# Altium project DSpico.PrjPcb
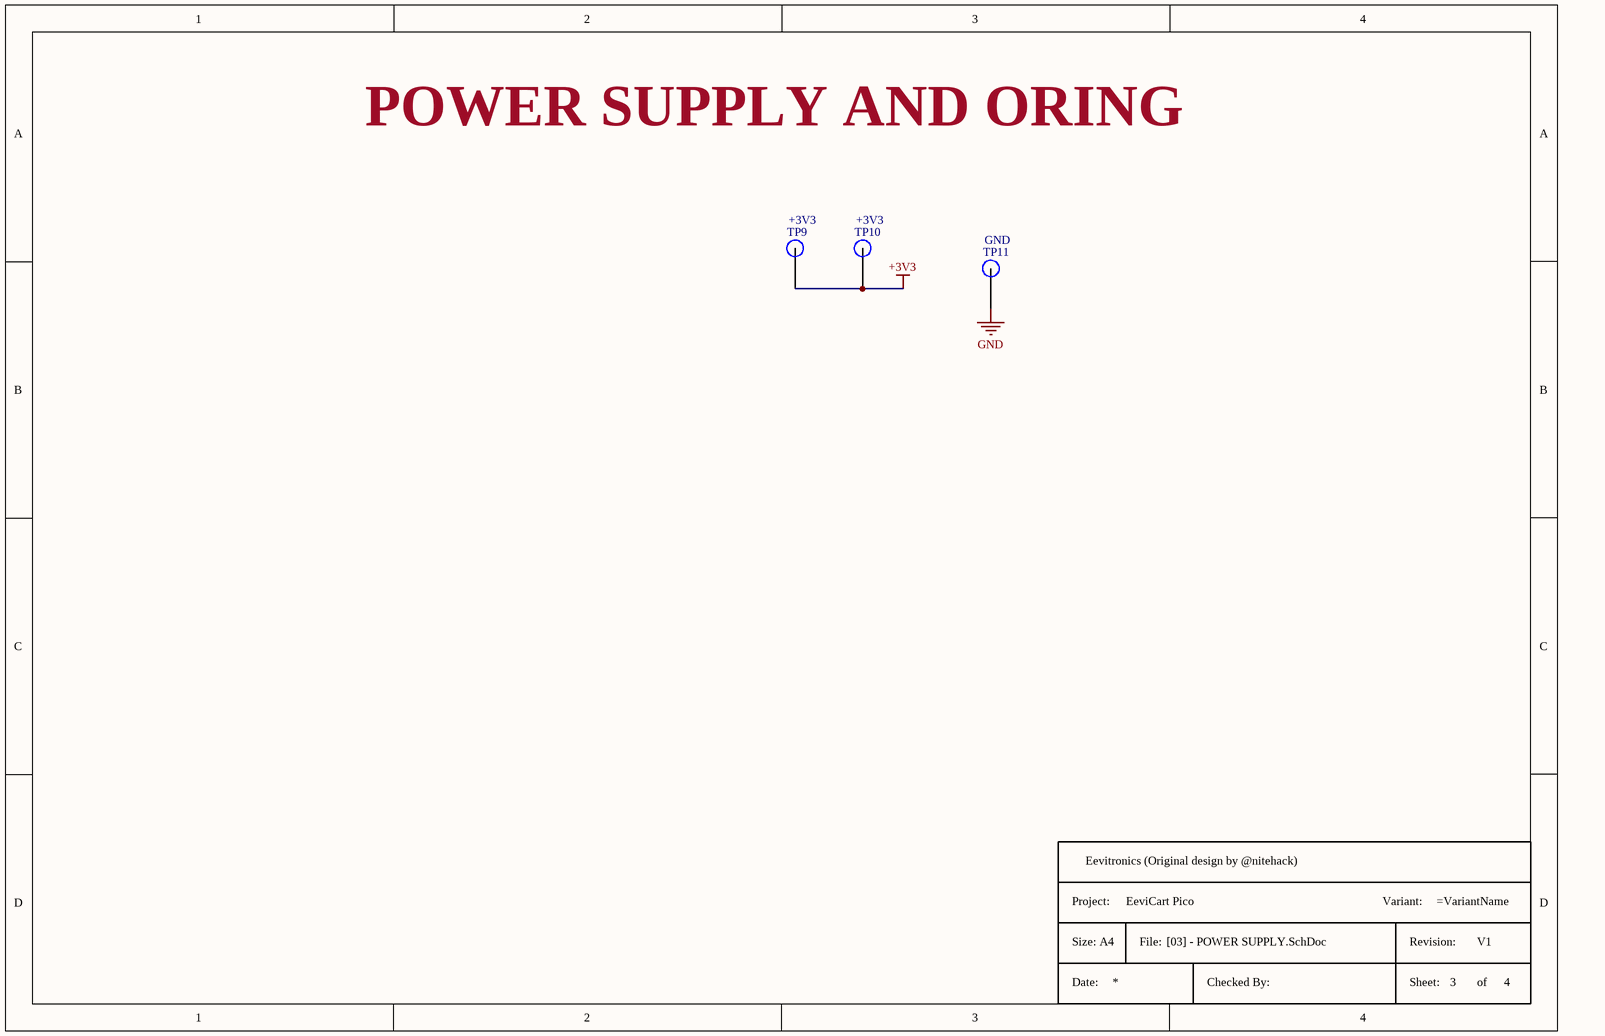
[diagram p0: [03] - POWER SUPPLY.SchDoc]
Year: 2026; VersionRevision: V1; Project: EeviCart Pico; Company: Eevitronics (Original design by @nitehack)
2 sheets, 54 parts. Net scope: global (net labels, ports and power ports of the same name join across sheets).
Board file: DSpico_PCB.PcbDoc
Sheets:
  [03] - POWER SUPPLY.SchDoc
  [04] - RP2040.SchDoc

## Sheet [03] - POWER SUPPLY.SchDoc
size A4; DocumentNumber: 3; SheetNumber: 3; SheetTotal: 4

### Parts
*?  Title Block A4  (value not drawn)  (graphical)
TP9  +3V3  [Test Point]
TP10  +3V3  [Test Point]
TP11  GND  [Test Point]

### Nets
+3V3: TP9.1 TP10.1
GND: TP11.1

### Notes on the sheet
- POWER SUPPLY AND ORING
- (in symbol Title Block A4) Project:; Variant:; Size: A4; File:; Revision:; Date:; Checked By:; Sheet:; of

### Library data of the parts
TP9-TP11 = Test Point

## Sheet [04] - RP2040.SchDoc
size A3; DocumentNumber: 4; SheetNumber: 4; SheetTotal: 4
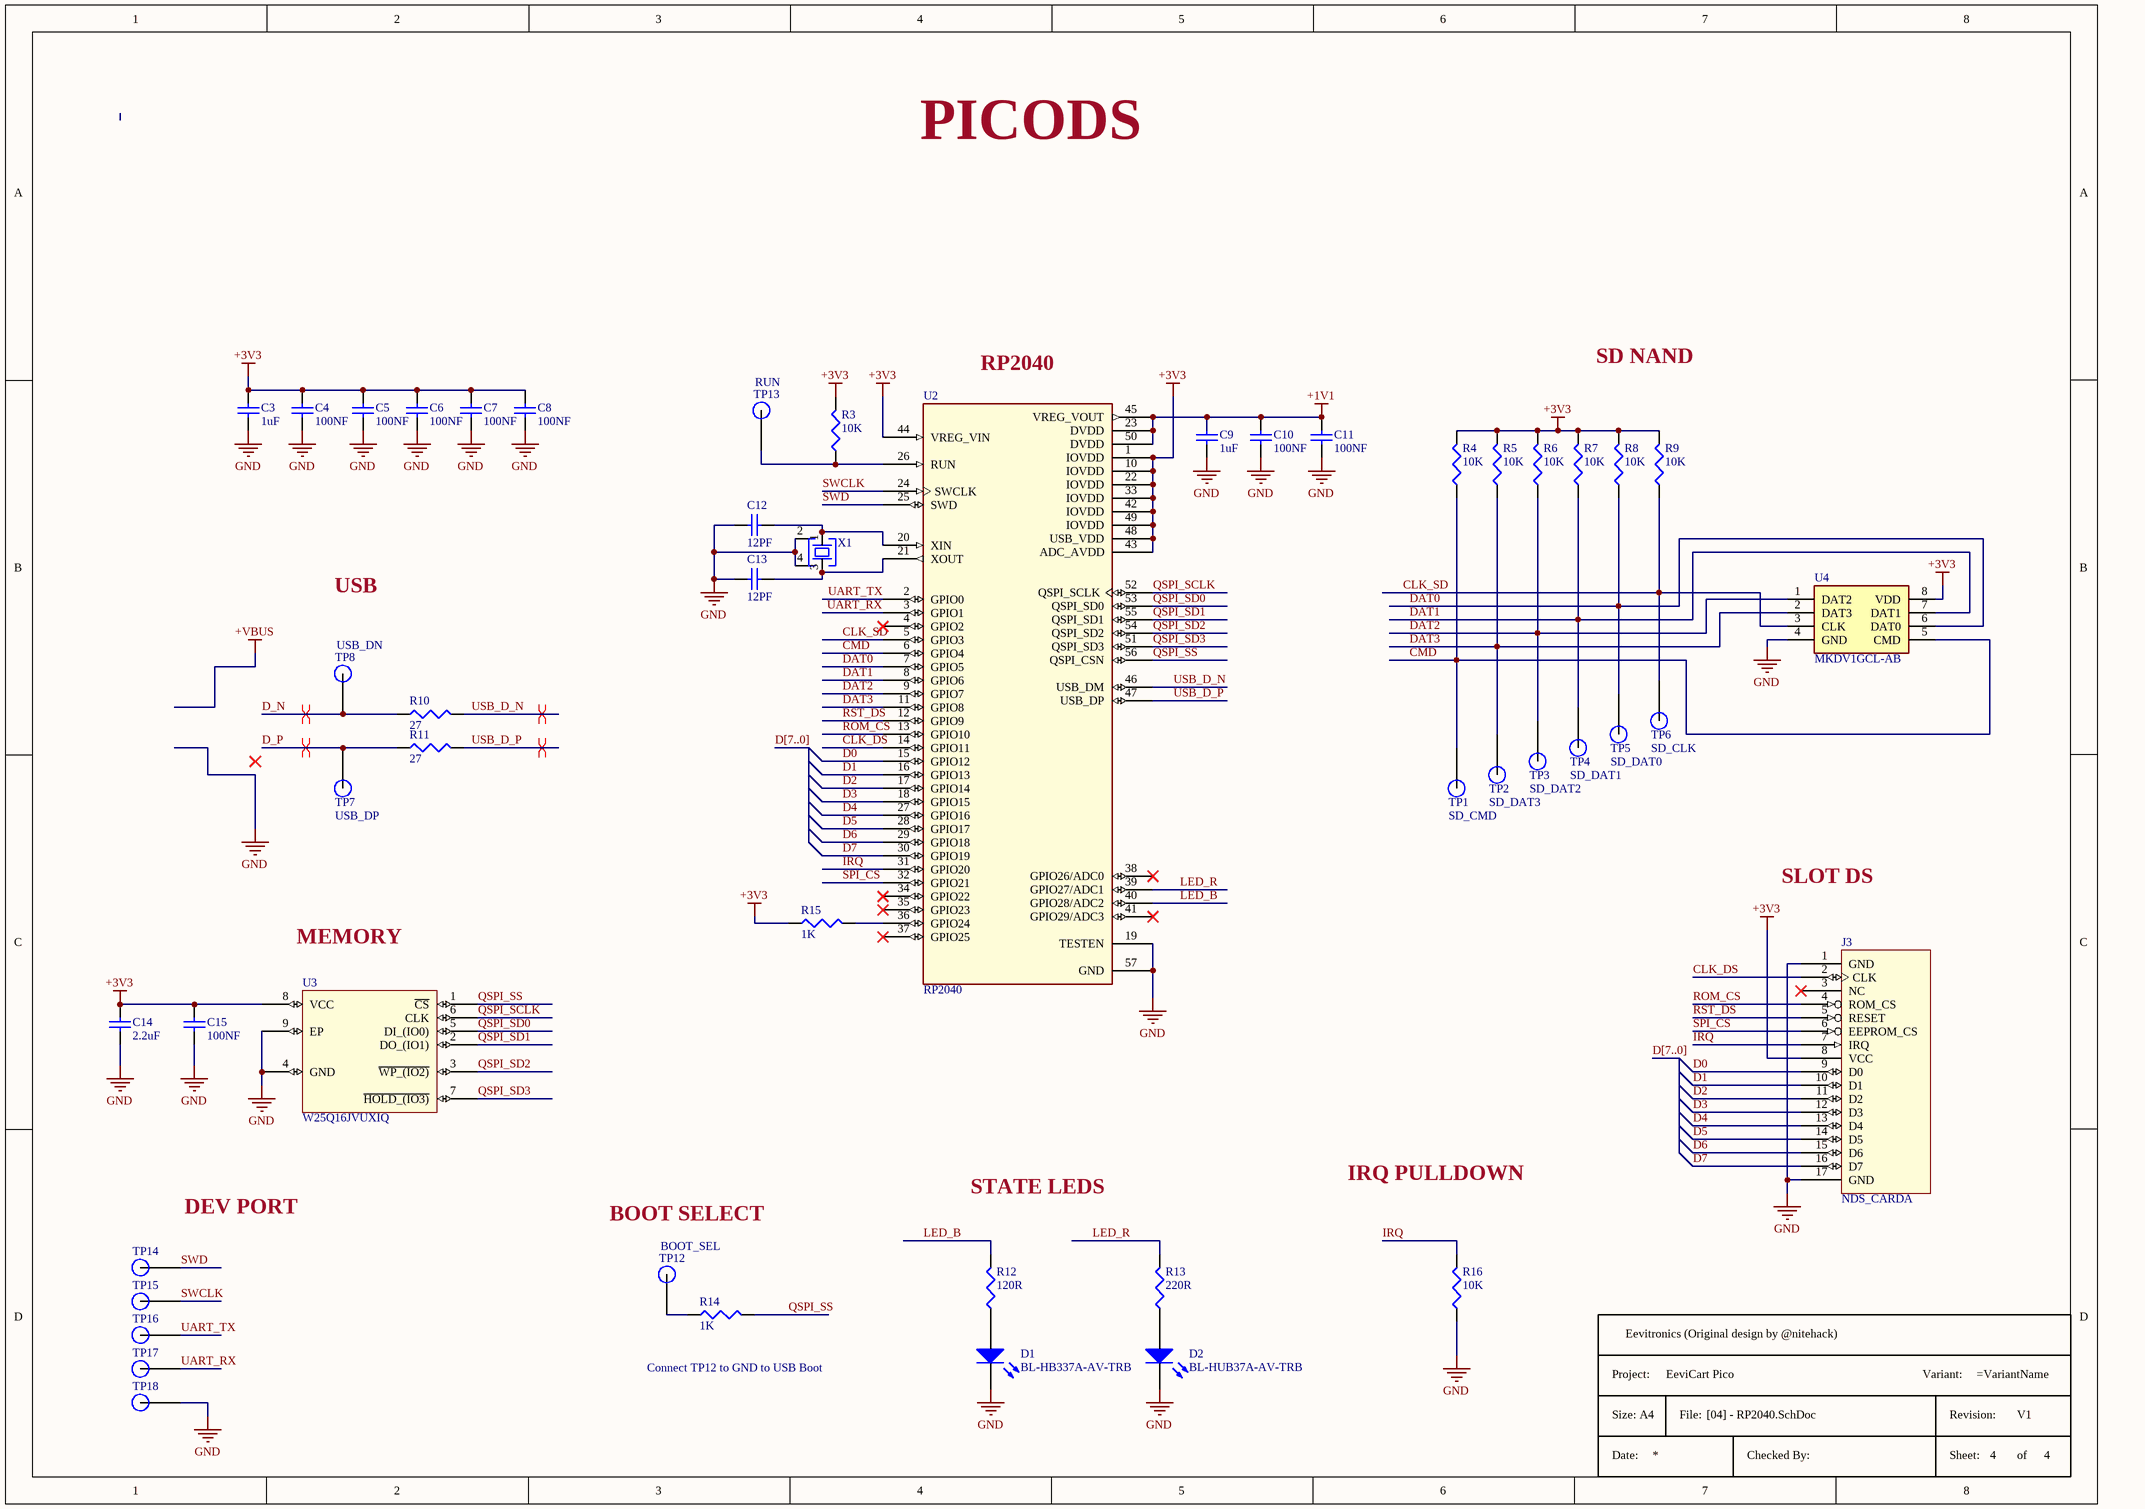
[diagram p1: [04] - RP2040.SchDoc]

### Parts
*  Title Block A4  (value not drawn)  (graphical)
C3  1uF  [C0402]
C4  100NF  [C0402]
C5  100NF  [C0402]
C6  100NF  [C0402]
C7  100NF  [C0402]
C8  100NF  [C0402]
C9  1uF  [C0402]
C10  100NF  [C0402]
C11  100NF  [C0402]
C12  12PF  [C0402]
C13  12PF  [C0402]
C14  2.2uF  [C0402]
C15  100NF  [C0402]
D1  BL-HB337A-AV-TRB  [LED0402-RD]
D2  BL-HUB37A-AV-TRB  [LED0402-RD]
J3  NDS_CARDA  [NDS_CARD]  (no BOM)
R3  10K  [R0402]
R4  10K  [R0402]
R5  10K  [R0402]
R6  10K  [R0402]
R7  10K  [R0402]
R8  10K  [R0402]
R9  10K  [R0402]
R10  value 27  [R0402]  (hidden comment: RC0402FR-0727RL)
R11  value 27  [R0402]  (hidden comment: RC0402FR-0727RL)
R12  120R  [R0402]
R13  220R  [R0402]
R14  1K  [R0402]
R15  1K  [R0402]
R16  10K  [R0402]
TP1  SD_CMD  [Test Point]
TP2  SD_DAT3  [Test Point]
TP3  SD_DAT2  [Test Point]
TP4  SD_DAT1  [Test Point]
TP5  SD_DAT0  [Test Point]
TP6  SD_CLK  [Test Point]
TP7  USB_DP  [Test Point]
TP8  USB_DN  [Test Point]
TP12  BOOT_SEL  [Test Point]
TP13  RUN  [Test Point]
TP14  (no value)  [Test Point]
TP15  (no value)  [Test Point]
TP16  (no value)  [Test Point]
TP17  (no value)  [Test Point]
TP18  (no value)  [Test Point]
U2  RP2040  [QFN40P700X700X90-57N]
U3  W25Q16JVUXIQ  [SON50P300X200X60-9N]
U4  MKDV1GCL-AB  [SON127P800X600X80-8N]
X1  XYDBPCNANF-12MHZ  [OSC-SMD_4P-L2.5-W2.0-BL]  (value not drawn)

### Nets
+1V1: C9.2 C10.2 C11.2 U2.23(DVDD) U2.45(VREG_VOUT) U2.50(DVDD)
+3V3: C3.2 C4.2 C5.2 C6.2 C7.2 C8.2 C14.2 C15.2 J3.8(VCC) R3.2 R4.2 R5.2 R6.2 R7.2 R8.2 R9.2 R15.1 U2.1(IOVDD) U2.10(IOVDD) U2.22(IOVDD) U2.33(IOVDD) U2.42(IOVDD) U2.43(ADC_AVDD) U2.44(VREG_VIN) U2.48(USB_VDD) U2.49(IOVDD) U3.8(VCC) U4.8(VDD)
GND: C3.1 C4.1 C5.1 C6.1 C7.1 C8.1 C9.1 C10.1 C11.1 C12.1 C13.1 C14.1 C15.1 D1.1 D2.1 J3.1(GND) J3.17(GND) R16.1 TP18.1 U2.19(TESTEN) U2.57(GND) U3.4(GND) U3.9(EP) U4.4(GND) X1.2 X1.4
CLK_DS: J3.2(CLK) U2.14(GPIO11)
CLK_SD: R9.1 TP6.1 U2.5(GPIO3) U4.3(CLK)
CMD: R4.1 TP1.1 U2.6(GPIO4) U4.5(CMD)
D0: J3.9(D0) U2.15(GPIO12)
D1: J3.10(D1) U2.16(GPIO13)
D2: J3.11(D2) U2.17(GPIO14)
D3: J3.12(D3) U2.18(GPIO15)
D4: J3.13(D4) U2.27(GPIO16)
D5: J3.14(D5) U2.28(GPIO17)
D6: J3.15(D6) U2.29(GPIO18)
D7: J3.16(D7) U2.30(GPIO19)
D_N: R10.1 TP8.1
D_P: R11.1 TP7.1
DAT0: R8.1 TP5.1 U2.7(GPIO5) U4.6(DAT0)
DAT1: R7.1 TP4.1 U2.8(GPIO6) U4.7(DAT1)
DAT2: R6.1 TP3.1 U2.9(GPIO7) U4.1(DAT2)
DAT3: R5.1 TP2.1 U2.11(GPIO8) U4.2(DAT3)
IRQ: J3.7(IRQ) R16.2 U2.31(GPIO20)
LED_B: R12.2 U2.40(GPIO28/ADC2)
LED_R: R13.2 U2.39(GPIO27/ADC1)
QSPI_SCLK: U2.52(QSPI_SCLK) U3.6(CLK)
QSPI_SD0: U2.53(QSPI_SD0) U3.5(DI_(IO0))
QSPI_SD1: U2.55(QSPI_SD1) U3.2(DO_(IO1))
QSPI_SD2: U2.54(QSPI_SD2) U3.3(~{WP_(IO2)})
QSPI_SD3: U2.51(QSPI_SD3) U3.7(~{HOLD_(IO3)})
QSPI_SS: R14.2 U2.56(QSPI_CSN) U3.1(~{CS})
ROM_CS: J3.4(ROM_CS) U2.13(GPIO10)
RST_DS: J3.5(RESET) U2.12(GPIO9)
SPI_CS: J3.6(EEPROM_CS) U2.32(GPIO21)
SWCLK: TP15.1 U2.24(SWCLK)
SWD: TP14.1 U2.25(SWD)
UART_RX: TP17.1 U2.3(GPIO1)
UART_TX: TP16.1 U2.2(GPIO0)
USB_D_N: R10.2 U2.46(USB_DM)
USB_D_P: R11.2 U2.47(USB_DP)
NetC12_2: C12.2 U2.20(XIN) X1.1
NetC13_2: C13.2 U2.21(XOUT) X1.3
NetD1_2: D1.2 R12.1
NetD2_2: D2.2 R13.1
NetR3_1: R3.1 TP13.1 U2.26(RUN)
NetR14_1: R14.1 TP12.1
NetR15_2: R15.2 U2.36(GPIO24)

Not connected (* = marked no-connect by the designer): J3 3(NC)*; U2 4(GPIO2)* 34(GPIO22)* 35(GPIO23)* 37(GPIO25)* 38(GPIO26/ADC0)* 41(GPIO29/ADC3)*

### Buses and harness runs
bus D[7..0]

### Layout directives
differential pair: D_N, D_P, USB_D_N, USB_D_P

### Notes on the sheet
- PICODS
- (near U2) RP2040
- SD NAND
- USB
- SLOT DS
- MEMORY
- IRQ PULLDOWN
- DEV PORT
- (near TP12) BOOT SELECT
- STATE LEDS
- (near R14) Connect TP12 to GND to USB Boot
- (in symbol Title Block A4) Project:; Variant:; Size: A4; File:; Revision:; Date:; Checked By:; Sheet:; of

### Library data of the parts
C3 C9 = C1005X5R1E105K050BC: TDK - C1005X5R1E105K050BC - COND, CERÁ MULT, X5R, 1UF, 25V, 0402; Dielectric Material: Ceramic; Tolerance: 10%; Supplier 1: Farnell; Supplier Part Number 1: 2346884; RoHS: YES; Stock: 131328; Pricing: 10=0,0948, 100=0,0638, 500=0,0468, 2500=0,0336, 5000=0,028, 10000=0,021, 50000=0,0175, 100000=0,0153 (EUR); ComponentLink1URL: http://www.farnell.com/datasheets/1796654.pdf; ComponentLink1Description: http://www.farnell.com/datasheets/1796654.pdf; .PCBCheck: *; .SCHCheck: *; Supplier 2: RSComponents; Supplier 3: Mouser; Supplier 4: Digi-Key; Supplier Part Number 2: 1110310; Supplier Part Number 3: 810-C1005X5R1E105K; Supplier Part Number 4: 445-9066-1-ND; Storage Location: C1-F2; Manufacturer: TDK; Manufacturer Part Number: C1005X5R1E105K050BC; Mount: Surface Mount; Case/Package: 0402; Weight: 2.3E-05oz; Case Code (Metric): 1005; Case Code (Imperial): 0402; Min Operating Temperature: -55°C; Max Operating Temperature: 85°C; Packaging: Tape and Reel; Capacitance: 1uF; Voltage Rating: 25V; Termination: SMD/SMT; Package Quantity: 1; Voltage Rating (DC): 25V; Dielectric: X5R; Composition: Ceramic; Length: 1mm; Height: 0.5mm; Width: 0.02inch; Thickness: 0.022inch; Depth: 0.5mm; Radiation Hardening: No; REACH SVHC: No SVHC; Lead Free: Lead Free
C4-C8 C10 C11 C15 = GRM155R71C104KA88D: 0402 0.1 uF 16V ±10 % Tolerance X7R SMT Multilayer Ceramic Capacitor; Manufacturer: Murata; Tolerance: 10%; Insulation Resistance: 10GR; Supplier 1: Digi-Key; Manufacturer Part Number: GRM155R71C104KA88D; RoHS: Yes; Category: Ceramic Capacitors; Stock 1: 30795639; Pricing 1: 1=0,10000, 10=0,02200, 50=0,01180, 100=0,00960, 500=0,00688, 1000=0,00541, 2500=0,00492, 5000=0,00452 (USD); Mount: Surface Mount; Case/Package: 0402; Number of Pins: 2; Case Code (Metric): 1005; Case Code (Imperial): 0402; Material: Ceramic; Dielectric Material: Ceramic; Min Operating Temperature: -55°C; Max Operating Temperature: 125°C; Capacitance: 100nF; Dielectric: X7R; Voltage Rating: 16V; Packaging: Tape and Reel; Voltage Rating (DC): 16V; Package Quantity: 1; Termination: SMD/SMT; Voltage: 16V; Length: 1mm; Width: 0.5mm; Height: 0.5mm; Thickness: 0.022inch; Depth: 0.5mm; Radiation Hardening: No; REACH SVHC: No SVHC; Lead Free: Lead Free; RoHS Compliant: Yes; ComponentLink1URL: https://datasheet.ciiva.com/129/grm155r71c104ka88-01-129739.pdf?src-supplier=Digi-Key; ComponentLink1Description: https://datasheet.ciiva.com/129/grm155r71c104ka88-01-129739.pdf?src-supplier=Digi-Key; ComponentLink2URL: https://datasheet.ciiva.com/129/grm155r71c104ka88-01-129740.pdf?src-supplier=Digi-Key; ComponentLink2Description: https://datasheet.ciiva.com/129/grm155r71c104ka88-01-129740.pdf?src-supplier=Digi-Key; ComponentLink3URL: https://datasheet.ciiva.com/18102/getdatasheetpartid-85307-18102905.pdf?src-supplier=Verical; ComponentLink3Description: https://datasheet.ciiva.com/18102/getdatasheetpartid-85307-18102905.pdf?src-supplier=Verical; ComponentLink4URL: https://datasheet.ciiva.com/29199/454098-da-01-en-vs-kondensator-0402-29199799.pdf?src-supplier=Conrad; ComponentLink4Description: https://datasheet.ciiva.com/29199/454098-da-01-en-vs-kondensator-0402-29199799.pdf?src-supplier=Conrad; ComponentLink5URL: https://datasheet.ciiva.com/7937/4360-7937615.pdf?src-supplier=Element14; ComponentLink5Description: https://datasheet.ciiva.com/7937/4360-7937615.pdf?src-supplier=Element14; ComponentLink6URL: https://datasheet.ciiva.com/14116/grmseries-highdielectrictype-eng-14116878.pdf?src-supplier=Distrelec; ComponentLink6Description: https://datasheet.ciiva.com/14116/grmseries-highdielectrictype-eng-14116878.pdf?src-supplier=Distrelec; ComponentLink7URL: https://datasheet.ciiva.com/14103/grmseries-highdielectrictype-eng-14103750.pdf?src-supplier=Distrelec; ComponentLink7Description: https://datasheet.ciiva.com/14103/grmseries-highdielectrictype-eng-14103750.pdf?src-supplier=Distrelec; ComponentLink8URL: https://datasheet.ciiva.com/28534/4360-28534127.pdf?src-supplier=Element14; ComponentLink8Description: https://datasheet.ciiva.com/28534/4360-28534127.pdf?src-supplier=Element14; ComponentLink9URL: https://datasheet.ciiva.com/28534/4360-28534133.pdf?src-supplier=Element14; ComponentLink9Description: https://datasheet.ciiva.com/28534/4360-28534133.pdf?src-supplier=Element14; ComponentLink10URL: https://datasheet.ciiva.com/16199/product-16199000.pdf?src-supplier=Future+Electronics; ComponentLink10Description: https://datasheet.ciiva.com/16199/product-16199000.pdf?src-supplier=Future+Electronics; Supplier Part Number 1: 490-3261-1-ND
C12 C13 = 04025A120JAT2A: CAP CER 12PF 50V C0G/NP0 0402; Manufacturer: Kyocera AVX; Tolerance: 5%; Dielectric: C0G; Temperature Coefficient: 30ppm/°C; Insulation Resistance: 100GR; Supplier 1: Newark; Manufacturer Part Number: 04025A120JAT2A; RoHS: Yes; Category: Ceramic Capacitors; Mount: Surface Mount,PCB; Case/Package: 0402; Number of Pins: 2; Case Code (Metric): 1005; Case Code (Imperial): 0402; Min Operating Temperature: -55°C; Max Operating Temperature: 125°C; Packaging: Tape and Reel; Capacitance: 12pF; Voltage Rating: 50V; Voltage Rating (DC): 50V; Package Quantity: 1; Series: -; Termination: SMD/SMT; Construction: Flat; Voltage: 50V; Length: 1mm; Width: 0.02inch; Height: 0.5mm; Depth: 0.5mm; Thickness: 0.022inch; Radiation Hardening: No; Lead Free: Lead Free; RoHS Compliant: Yes; Reach SVHC Compliant: Yes; Supplier Part Number 1: 96M1132
C14 = C1005X5R1A225K050BC: TDK - C1005X5R1A225K050BC - COND, CERÁ MULT, X5R, 2.2UF, 10V, 0402; .PCBCheck: VMM; Supplier 1: Farnell; Manufacturer: TDK; Manufacturer Part Number: C1005X5R1A225K050BC; RoHS: YES; Stock 1: 13179; Pricing 1: 5=0.142, 300=0.0926, 1000=0.0836, 2500=0.0667, 5000=0.0564 (EUR); ComponentLink1URL: http://bcove.me/dwwzmldz; ComponentLink1Description: http://bcove.me/dwwzmldz; ComponentLink2URL: http://www.farnell.com/datasheets/1913358.pdf; ComponentLink2Description: http://www.farnell.com/datasheets/1913358.pdf; Supplier 2: Mouser; Supplier 3: Digi-Key; Supplier Part Number 1: 2346879; Supplier Part Number 2: 810-C1005X5R1A225K; Supplier Part Number 3: 445-7392-1-ND; .SCHCheck: VMM
D1 = BL-HB337A-AV-TRB: Blue 0402 1X.5X4MM; Manufacturer: American Bright; Lens Color: Colorless; Lens Style: Flat; Lens Transparency: Clear; Luminous Intensity: 35mcd; Forward Voltage: 2.8V; Test Current: 20mA; Viewing Angle: 120°; Dominant Wavelength: 571nm; Lens Size: 0.5mm; Manufacturer Part Number: BL-HB337A-AV-TRB; RoHS: Yes; Category: LEDs; Stock 1: 2065; Pricing 1: 1=0,35000, 10=0,27300, 100=0,12260, 500=0,11074, 1000=0,09097 (USD); Mount: Surface Mount; Case/Package: 0402; Color: Blue; Case Code (Imperial): 0402; Case Code (Metric): 1005; Packaging: Cut Tape; Length: 1mm; Width: 0.5mm; Height: 0.45mm; RoHS Compliant: Yes; ComponentLink1URL: http://www.americanbrightled.com/pdffiles/smt/BL-HGE37A-AV-TRB.pdf?src-supplier=Digi-Key; ComponentLink1Description: http://www.americanbrightled.com/pdffiles/smt/BL-HGE37A-AV-TRB.pdf?src-supplier=Digi-Key
D2 = BL-HUB37A-AV-TRB: Red 0402 1X.5X4MM; Manufacturer: American Bright; Lens Color: Colorless; Lens Style: Flat; Lens Transparency: Clear; Luminous Intensity: 35mcd; Forward Voltage: 2V; Test Current: 20mA; Viewing Angle: 120°; Dominant Wavelength: 571nm; Lens Size: 0.5mm; Manufacturer Part Number: BL-HUB37A-AV-TRB; RoHS: Yes; Category: LEDs; Stock 1: 2065; Pricing 1: 1=0,35000, 10=0,27300, 100=0,12260, 500=0,11074, 1000=0,09097 (USD); Mount: Surface Mount; Case/Package: 0402; Color: Red; Case Code (Imperial): 0402; Case Code (Metric): 1005; Packaging: Cut Tape; Length: 1mm; Width: 0.5mm; Height: 0.45mm; RoHS Compliant: Yes; ComponentLink1URL: http://www.americanbrightled.com/pdffiles/smt/BL-HGE37A-AV-TRB.pdf?src-supplier=Digi-Key; ComponentLink1Description: http://www.americanbrightled.com/pdffiles/smt/BL-HGE37A-AV-TRB.pdf?src-supplier=Digi-Key
J3 = NDS_CARDA: SymbolName_1: NDS_CONNECTOR; DeviceName: A; GateName_1: NDS_CARD; LibraryName: nds; DeviceSetName: NDS_CARD
R3-R9 = CRCW040210K0FKED: VISHAY DRALORIC - CRCW040210K0FKED - RESISTENCIA, 10K, 0.063W, 1%, 0402, SMD; Resistance: 10kR; Temperature Coefficient: 100ppm/°C; Power Rating: 63mW; Voltage Rating: 50V; Supplier 1: Farnell; Supplier Part Number 1: 1469669; RoHS: Y-EX; Stock: 0; Pricing: 10=0.0147, 100=0.0113, 500=0.0091, 2500=0.007, 5000=0.0055 (GBP); ComponentLink1URL: http://www.farnell.com/datasheets/1720486.pdf; ComponentLink1Description: http://www.farnell.com/datasheets/1720486.pdf; ComponentLink2URL: http://www.farnell.com/cad/1551228.zip; ComponentLink2Description: http://www.farnell.com/cad/1551228.zip; .PCBCheck: *; .SCHCheck: *; Manufacturer: Vishay; Manufacturer Part Number: CRCW040210K0FKED; Mount: Surface Mount; Case/Package: 0402; Number of Pins: 2; Weight: 2.3E-05oz; Contact Plating: Tin; Case Code (Metric): 1005; Case Code (Imperial): 0402; Min Operating Temperature: -55°C; Max Operating Temperature: 155°C; Tolerance: 1%; Composition: Thick Film; Termination: SMD/SMT; Package Quantity: 10; Packaging: Tape and Reel; Military Standard: Not; Voltage Rating (DC): 50V; Number of Terminations: 2; Max Power Dissipation: 63mW; Features: Automotive AEC-Q200; Length: 1mm; Height: 0.35mm; Width: 0.02inch; Depth: 0.5mm; Radiation Hardening: No; Lead Free: Lead Free; REACH SVHC: Unknown; Supplier 2: RSComponents; Supplier 3: Mouser; Supplier 4: Digi-Key; Storage Location: C1-F2; Supplier Part Number 2: 6784697; Supplier Part Number 3: 71-CRCW0402-10K-E3; Supplier Part Number 4: 541-10.0KLTR-ND
R10 R11 = RC0402FR-0727RL: RES 27 OHM 1% 1/16W 0402; Package Height: 0.35mm; Rated Power Dissipation (P): 62.5mW; Rated Temperature: 70°C; Additional Feature: LASER TRIMMABLE; Resistance: 27R; Package Length: 1mm; Temperature Coefficient: 100ppm/°C; Package Width: 0.5mm; Working Voltage: 50V; JESD-609 Code: e3; Package Shape: Rectangular; Case/Package: 0402; Package Style: SMTMeter; Technology: METAL GLAZE/THICK FILM; Termination: Wraparound; Packaging: Tape and Reel; Resistor Type: FIXED RESISTOR; Max Operating Temperature: 155°C; Mount: Surface Mount; REACH SVHC: Yes; Terminal Finish: Nickel; Size Code: 0402; RoHS Compliant: Yes; Min Operating Temperature: -55°C; Tolerance: 1%; Construction: Chip; Number of Pins: 2
R12 = RC0402FR-07120RL: Res General Purpose Thick Film 0402 120 Ohm 1% 1/16W ±100ppm/°C Molded Paper T/R; Manufacturer: Yageo; Voltage Rating: 50V; Power Rating: 62.5mW; Max Power Dissipation: 63mW; Supplier 1: Farnell; Manufacturer Part Number: RC0402FR-07120RL; RoHS: Yes; Category: Chip SMD Resistors; Stock 1: 238785; Pricing 1: 10=0,0101, 100=0,0056, 500=0,0044, 2500=0,0032, 5000=0,0026, 10000=0,002, 50000=0,0019, 100000=0,0018 (EUR); Case/Package: 0402; Case Code (Imperial): 0402; Case Code (Metric): 1005; Min Operating Temperature: -55°C; Max Operating Temperature: 155°C; Packaging: Tape and Reel; Tolerance: 1%; Resistance: 120R; Resistor Type: Thick Film; Number of Terminations: 2; Termination: SMD/SMT; Temperature Coefficient: 100ppm/°C; Features: Moisture Resistant; Series: RC; Length: 0.039inch; Width: 0.02inch; Height: 0.016inch; Lead Free: 5697LeadFree; RoHS Compliant: Yes; ComponentLink1URL: https://datasheet.ciiva.com/12667/pyu-rc0402-51-rohs-l-6-r-12667958.pdf?src-supplier=Mouser; ComponentLink1Description: https://datasheet.ciiva.com/12667/pyu-rc0402-51-rohs-l-6-r-12667958.pdf?src-supplier=Mouser; Supplier Part Number 1: 9239120; Size Code: 0402; Package Quantity: 1; Resistance Tolerance: 1%; Construction: Rectangular; Technology: THICK FILM; Voltage Rating (AC): 50V; Depth: 0.5mm; Reach SVHC Compliant: No; Military Standard: Not; ComponentLink2URL: https://datasheet.ciiva.com/7849/1018594-7849831.pdf?src-supplier=Element14; ComponentLink2Description: https://datasheet.ciiva.com/7849/1018594-7849831.pdf?src-supplier=Element14; Value: 120R
R13 = RC0402FR-07220RL: SMD Chip Resistor, 220 Ohm, ± 1%, 62.5 mW, 0402 [1005 Metric], Thick Film, General Purpose; Manufacturer: Yageo; Voltage Rating: 50V; Power Rating: 62.5mW; Max Power Dissipation: 63mW; Temperature Coefficient: 100ppm/°C; Supplier 1: Farnell; Manufacturer Part Number: RC0402FR-07220RL; RoHS: Yes; Category: Chip SMD Resistors; Stock 1: 412549; Pricing 1: 10=0,0099, 100=0,0055, 500=0,0044, 2500=0,0032, 5000=0,0031 (EUR); Case/Package: 0402; Case Code (Imperial): 0402; Case Code (Metric): 1005; Min Operating Temperature: -55°C; Max Operating Temperature: 155°C; Packaging: Tape and Reel; Tolerance: 1%; Resistance: 220R; Resistor Type: Thick Film; Number of Terminations: 2; Termination: SMD/SMT; Features: Moisture Resistant; Series: RC; Length: 0.039inch; Width: 0.02inch; Height: 0.016inch; Lead Free: 5697LeadFree; RoHS Compliant: Yes; ComponentLink1URL: http://www.farnell.com/datasheets/2167052.pdf?src-supplier=Farnell; ComponentLink1Description: http://www.farnell.com/datasheets/2167052.pdf?src-supplier=Farnell; Supplier Part Number 1: 9239154; Number of Pins: 2; Size Code: 0402; Voltage Rating (DC): 50V; Package Quantity: 1; Resistance Tolerance: 1%; Construction: Rectangular; Technology: THICK FILM; Voltage Rating (AC): 50V; Depth: 0.5mm; Reach SVHC Compliant: No; Military Standard: Not; ComponentLink2URL: http://www.farnell.com/datasheets/1018594.pdf?src-supplier=Farnell; ComponentLink2Description: http://www.farnell.com/datasheets/1018594.pdf?src-supplier=Farnell; ComponentLink3URL: http://www.farnell.com/datasheets/1686128.pdf?src-supplier=Element14; ComponentLink3Description: http://www.farnell.com/datasheets/1686128.pdf?src-supplier=Element14; ComponentLink4URL: http://www.farnell.com/datasheets/2167052.pdf?src-supplier=Newark; ComponentLink4Description: http://www.farnell.com/datasheets/2167052.pdf?src-supplier=Newark; ComponentLink5URL: http://www.farnell.com/datasheets/2167052.pdf?src-supplier=Element14; ComponentLink5Description: http://www.farnell.com/datasheets/2167052.pdf?src-supplier=Element14; ComponentLink6URL: https://datasheet.octopart.com/RC0402FR-07220RL-Yageo-datasheet-10408619.pdf?src-supplier=Element14; ComponentLink6Description: https://datasheet.octopart.com/RC0402FR-07220RL-Yageo-datasheet-10408619.pdf?src-supplier=Element14; Value: 220R
R14 R15 = CRCW04021K00FKEDC: VISHAY - CRCW04021K00FKED - RES, PELÍC GRUESA, 1K, 1%, 0.063W, 0402; Resistencia: 1; Tensión Nominal: 50; Tipo de Resistencia: 0402 [Métrica 1005]; Potencia Nominal: 63; Rango de Producto: Serie AEC-Q200 CRCW; Encapsulado: Cinta Cortada; Tipo de Elemento Resistivo: Película Gruesa; Coeficiente de Temperatura: ± 100; Estándar de Certificación para Automoción: AEC-Q200; Nivel de Sensibilidad a la Humedad (MSL): MSL 1 - Ilimitado; Núm. de Contactos Macho: 2; Rango de Temperatura de Funcionamiento: -55°C a +155; Resistencia, Montaje: Dispositivo de Montaje Superficial (SMD); Temperatura de Trabajo Máx.: 155; Temperatura de Trabajo Mín.: -55°C<!--FANDB--><div class="features-and-benefits-container"><div class="features-and-benefits-description"><span class="features-benefits-value">The Vishay D/CRCW e3 series are standard thick film chip resistors. The resistance range includes E96 and E24 decade values from 1ohm to 10Mohm. CRCW e3 series resistors have a pure tin solder contacts on the Ni barrier layer that provides compatibility with reflow soldering process.</span></div><div class="features-and-benefits-list"><ul class="features-and-benefits-list-list"><li class="features-and-benefits-list-item">Automotive grade AEC-Q200 qualified</li><li class="features-and-benefits-list-item">EIA 0402, 0603, 0805, 1206, 1210, 1218, 2010, 2512 standard case sizes available</li><li class="features-and-benefits-list-item">Stability &Delta; Supplier 1: Farnell; Manufacturer: VISHAY; Manufacturer Part Number: CRCW04021K00FKED; RoHS: Y-EX; Stock 1: 83181; Pricing 1: 10=0,0125, 400=0,0097, 1000=0,0069, 2500=0,0057, 5000=0,0041 (EUR); Tolerancia de Resistencia: ± 1%; ComponentLink1URL: http://www.farnell.com/datasheets/2111203.pdf; ComponentLink1Description: http://www.farnell.com/datasheets/2111203.pdf; ComponentLink2URL: http://www.farnell.com/cad/1551424.zip; ComponentLink2Description: http://www.farnell.com/cad/1551424.zip; Supplier 2: Digi-Key; Supplier Part Number 1: 1469662; Supplier Part Number 2: 541-1.00KLCT-ND
R16 = RC0402FR-07220RL: SMD Chip Resistor, 220 Ohm, ± 1%, 62.5 mW, 0402 [1005 Metric], Thick Film, General Purpose; Manufacturer: Yageo; Voltage Rating: 50V; Power Rating: 62.5mW; Resistance: 220R; Max Power Dissipation: 63mW; Temperature Coefficient: 100ppm/°C; Value: 220R; Supplier 1: Farnell; Manufacturer Part Number: RC0402FR-07220RL; RoHS: Yes; Category: Chip SMD Resistors; Stock 1: 412549; Pricing 1: 10=0,0099, 100=0,0055, 500=0,0044, 2500=0,0032, 5000=0,0031 (EUR); Case/Package: 0402; Case Code (Imperial): 0402; Case Code (Metric): 1005; Min Operating Temperature: -55°C; Max Operating Temperature: 155°C; Packaging: Tape and Reel; Tolerance: 1%; Resistor Type: Thick Film; Number of Terminations: 2; Termination: SMD/SMT; Features: Moisture Resistant; Series: RC; Length: 0.039inch; Width: 0.02inch; Height: 0.016inch; Lead Free: 5697LeadFree; RoHS Compliant: Yes; ComponentLink1URL: http://www.farnell.com/datasheets/2167052.pdf?src-supplier=Farnell; ComponentLink1Description: http://www.farnell.com/datasheets/2167052.pdf?src-supplier=Farnell; Supplier Part Number 1: 9239154; Number of Pins: 2; Size Code: 0402; Voltage Rating (DC): 50V; Package Quantity: 1; Resistance Tolerance: 1%; Construction: Rectangular; Technology: THICK FILM; Voltage Rating (AC): 50V; Depth: 0.5mm; Reach SVHC Compliant: No; Military Standard: Not; ComponentLink2URL: http://www.farnell.com/datasheets/1018594.pdf?src-supplier=Farnell; ComponentLink2Description: http://www.farnell.com/datasheets/1018594.pdf?src-supplier=Farnell; ComponentLink3URL: http://www.farnell.com/datasheets/1686128.pdf?src-supplier=Element14; ComponentLink3Description: http://www.farnell.com/datasheets/1686128.pdf?src-supplier=Element14; ComponentLink4URL: http://www.farnell.com/datasheets/2167052.pdf?src-supplier=Newark; ComponentLink4Description: http://www.farnell.com/datasheets/2167052.pdf?src-supplier=Newark; ComponentLink5URL: http://www.farnell.com/datasheets/2167052.pdf?src-supplier=Element14; ComponentLink5Description: http://www.farnell.com/datasheets/2167052.pdf?src-supplier=Element14; ComponentLink6URL: https://datasheet.octopart.com/RC0402FR-07220RL-Yageo-datasheet-10408619.pdf?src-supplier=Element14; ComponentLink6Description: https://datasheet.octopart.com/RC0402FR-07220RL-Yageo-datasheet-10408619.pdf?src-supplier=Element14
TP1-TP8 TP12-TP18 = Test Point
U2 = RP2040: RP2040 chip for Raspberry Pi Pico - ARM Cortex-M0+ MCU 32-Bit; Check_prices: https://www.snapeda.com/parts/RP2040/Raspberry+Pi/view-part/?ref=eda; Value: *; Availability: In Stock; MP: RP2040; Price: None; Package: None; SnapEDA_Link: https://www.snapeda.com/parts/RP2040/Raspberry+Pi/view-part/?ref=snap; Purchase-URL: https://pricing.snapeda.com/search/part/RP2040/?ref=eda; MF: Raspberry Pi
U3 = W25Q16JVUXIQ: NOR Flash Serial (SPI, Dual SPI, Quad SPI) 3V/3.3V 16M-bit 2M x 8 6ns 8-Pin USON EP T/R; MF: Winbond; Value: *; Purchase-URL: https://pricing.snapeda.com/search/part/W25Q16JVUXIQ/?ref=eda; Package: UFDFN-8 Winbond; Check_prices: https://www.snapeda.com/parts/W25Q16JVUXIQ/Winbond/view-part/?ref=eda; MP: W25Q16JVUXIQ; Price: None; SnapEDA_Link: https://www.snapeda.com/parts/W25Q16JVUXIQ/Winbond/view-part/?ref=snap; Availability: In Stock
U4 = MKDV1GCL-AB: Integrated Circuit; Manufacturer_Name: MK; Datasheet Link: https://datasheet.lcsc.com/lcsc/2110081830_MK-MKDV1GCL-AB_C2686055.pdf; Height: 0.8mm; Manufacturer_Part_Number: MKDV1GCL-AB

## Nets that join several sheets
+3V3: [03] - POWER SUPPLY (TP9.1 TP10.1), [04] - RP2040 (28 pins)
GND: [03] - POWER SUPPLY (TP11.1), [04] - RP2040 (26 pins)